# Altium schematic sheet USB2UART.SchDoc: USB to UART Converter
size A4; DrawnBy: Parsa Malekpour; Organization: Atrotech; Address1: L3, 12a Rodborough Rd; Address2: Frenchs Forest; Address3: NSW; Address4: Australia 2086; DocumentNumber: 7; Revision: 1.0; SheetNumber: 7; SheetTotal: 10
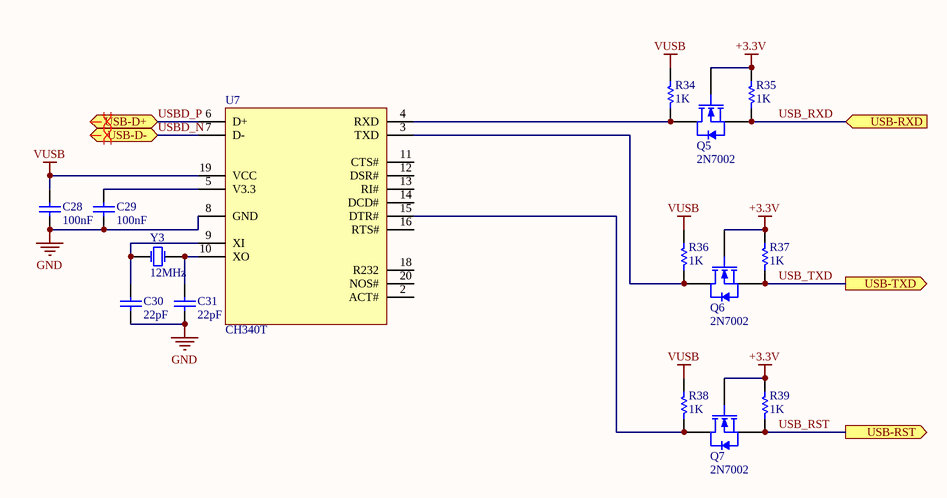
[diagram p0: USB2UART.SchDoc]

## Parts
C28  100nF  [C603]
C29  100nF  [C603]
C30  22pF  [C603]
C31  22pF  [C603]
Q5  2N7002  [SOT-23]
Q6  2N7002  [SOT-23]
Q7  2N7002  [SOT-23]
R34  1K  [R0603]
R35  1K  [R0603]
R36  1K  [R0603]
R37  1K  [R0603]
R38  1K  [R0603]
R39  1K  [R0603]
U7  CH340T  [SSOP-20n]
Y3  12MHz  [XTAL-SMD]

## Ports
USB-D+ (bidir), USB-D- (bidir), USB-RST (out), USB-RXD (in), USB-TXD (out)

## Nets
+3.3V: Q5.1(G) Q6.1(G) Q7.1(G) R35.2 R37.2 R39.2
GND: C28.1 C29.1 C30.1 C31.1 U7.8(GND)
VUSB: C28.2 R34.2 R36.2 R38.2 U7.19(VCC)
USB_RST: Q7.2(S) R39.1 ; port USB-RST
USB_RXD: Q5.2(S) R35.1 ; port USB-RXD
USB_TXD: Q6.2(S) R37.1 ; port USB-TXD
USBD_N: U7.7(D-) ; port USB-D-
USBD_P: U7.6(D+) ; port USB-D+
NetC29_2: C29.2 U7.5(V3.3)
NetC30_2: C30.2 U7.9(XI) Y3.1(OSC1)
NetC31_2: C31.2 U7.10(XO) Y3.2(OSC2)
NetQ5_3: Q5.3(D) R34.1 U7.4(RXD)
NetQ6_3: Q6.3(D) R36.1 U7.3(TXD)
NetQ7_3: Q7.3(D) R38.1 U7.15(DTR#)

Not connected (* = marked no-connect by the designer): U7 1(CKO) 2(ACT#) 11(CTS#) 12(DSR#) 13(RI#) 14(DCD#) 16(RTS#) 17(IR#) 18(R232) 20(NOS#)

## Layout directives
differential pair: USBD_N, USBD_P

## Notes on the sheet
- Title
- Size:
- Date:
- A4
- Number:
- Time:
- Revision:
- Sheet
- of
- Atrotech co.
- www.atrotech.ir <http://www.atrotech.ir>
- +98 90 369 22 999
- Tehran
- IRAN
- File:

## Library data of the parts
C28-C31 = Cap: Capacitor; Designer: Parsa Malekpour
  C28 C29: Value: 100nF
  C30 C31: Value: 22pF
Q5-Q7 = 2N7002: N-channel Enhancement Mode Field-effect Transistor; Published: 17-Sep-2003; LatestRevisionDate: 12-Dec-2006; LatestRevisionNote: IPC-7351 Footprint Added.; DatasheetVersion: 27-Jul-2000; PackageVersion: May-1999; PackageReference: SOT23; Publisher: Altium Limited; PackageDescription: 3-Pin SOT-23 Package 0.95 mm Pitch, 2.3 mm Lead Span; ComponentLink1Description: Manufacturer Link; ComponentLink1URL: http://www.semiconductors.philips.com/; ComponentLink2Description: Datasheet; ComponentLink2URL: http://www.semiconductors.philips.com/acrobat/datasheets/2N7002_4.pdf
R34-R39 = RES: Resistor; Designer: Parsa Malekpour; Value: 1K
U7 = CH340T: USB Bus Convert Chip and It Can Realize USB Convert to Serial Interface
Y3 = XTAL: Crystal Oscillator; Designer: Parsa Malekpour; Email: Malekpour.parsa@Gmail.com; Value: 12MHz